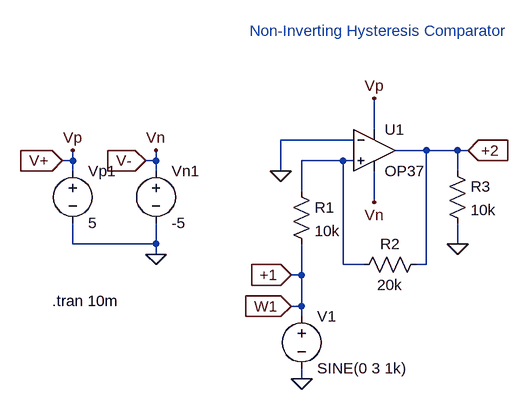
[diagram p0: schematic noninv_hys_comp.asc]
noninv_hys_comp.asc, the LTspice schematic file:
Version 4
SHEET 1 880 680
WIRE -656 16 -656 -32
WIRE -688 32 -800 32
WIRE -576 48 -624 48
WIRE -528 48 -576 48
WIRE -512 48 -528 48
WIRE -1120 64 -1120 48
WIRE -1120 64 -1136 64
WIRE -992 64 -992 48
WIRE -992 64 -1008 64
WIRE -704 64 -768 64
WIRE -688 64 -704 64
WIRE -1120 80 -1120 64
WIRE -992 80 -992 64
WIRE -800 80 -800 32
WIRE -528 80 -528 48
WIRE -768 112 -768 64
WIRE -656 128 -656 80
WIRE -1120 192 -1120 160
WIRE -992 192 -992 160
WIRE -992 192 -1120 192
WIRE -528 192 -528 160
WIRE -992 208 -992 192
WIRE -704 224 -704 64
WIRE -672 224 -704 224
WIRE -576 224 -576 48
WIRE -576 224 -592 224
WIRE -768 240 -768 192
WIRE -768 240 -784 240
WIRE -768 288 -768 240
WIRE -768 288 -784 288
WIRE -768 304 -768 288
WIRE -768 400 -768 384
FLAG -768 400 0
FLAG -656 128 Vn
FLAG -656 -32 Vp
FLAG -528 192 0
FLAG -800 80 0
FLAG -784 240 +1
IOPIN -784 240 In
FLAG -512 48 +2
IOPIN -512 48 In
FLAG -784 288 W1
IOPIN -784 288 In
FLAG -992 208 0
FLAG -1120 48 Vp
FLAG -992 48 Vn
FLAG -1136 64 V+
IOPIN -1136 64 In
FLAG -1008 64 V-
IOPIN -1008 64 In
SYMBOL voltage -768 288 R0
WINDOW 123 0 0 Left 0
WINDOW 39 0 0 Left 0
SYMATTR InstName V1
SYMATTR Value SINE(0 3 1k)
SYMBOL res -544 64 R0
SYMATTR InstName R3
SYMATTR Value 10k
SYMBOL res -784 96 R0
SYMATTR InstName R1
SYMATTR Value 10k
SYMBOL res -576 208 R90
WINDOW 0 0 56 VBottom 2
WINDOW 3 32 56 VTop 2
SYMATTR InstName R2
SYMATTR Value 20k
SYMBOL Opamps\\OP37 -656 -16 R0
SYMATTR InstName U1
SYMBOL voltage -992 64 R0
WINDOW 123 0 0 Left 0
WINDOW 39 0 0 Left 0
SYMATTR InstName Vn1
SYMATTR Value -5
SYMBOL voltage -1120 64 R0
WINDOW 123 0 0 Left 0
WINDOW 39 0 0 Left 0
SYMATTR InstName Vp1
SYMATTR Value 5
TEXT -848 -136 Left 2 ;Non-Inverting Hysteresis Comparator
TEXT -1152 280 Left 2 !.tran 10m

The netlist it stands for:
* noninv_hys_comp.asc
V1 W1 0 SINE(0 3 1k)
R3 +2 0 10k
R1 N001 W1 10k
R2 +2 N001 20k
XU1 N001 0 V+ V- +2 LT1037  ; OP37, pins In+ In- V+ V- OUT
Vn1 V- 0 -5
Vp1 V+ 0 5
* Non-Inverting Hysteresis Comparator
.tran 10m
.lib LTC.lib
.backanno
.end